# Altium schematic sheet Buzzer and Relay.SchDoc
size A; SheetNumber: 4; SheetTotal: 8; SPICEModelCacheVCIOZCSS: <root> / <DocumentId>VCIOZCSS</DocumentId> / </root>
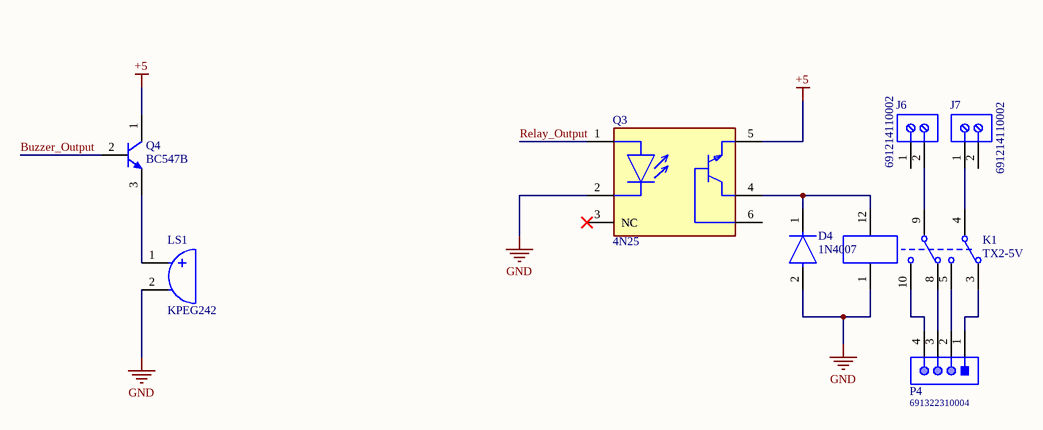
[diagram p0: Buzzer and Relay.SchDoc]

## Parts
D4  1N4007  [FP-1N4007-MFG]
J6  691214110002  [691214110002]
J7  691214110002  [691214110002]
K1  TX2-5V  [PNSC-TX2-5V_V]
LS1  KPEG242  [KINGS-KPEG242-2]
P4  691322310004  [691322310004]
Q3  4N25  [FP-4N25-MFG]
Q4  BC547B  [ONSC-TO-92-3-29-11]

## Nets
+5: Q3.5(C) Q4.1(C)
GND: D4.2(A) K1.1 LS1.2 Q3.2(C)
Buzzer_Output: Q4.2(B)
Relay_Output: Q3.1(A)
NetD4_1: D4.1(C) K1.12 Q3.4(E)
NetJ6_2: J6.2 K1.9
NetJ7_1: J7.1 K1.4
NetK1_3: K1.3 P4.1
NetK1_5: K1.5 P4.2
NetK1_8: K1.8 P4.3
NetK1_10: K1.10 P4.4
NetLS1_1: LS1.1 Q4.3(E)

Not connected (* = marked no-connect by the designer): J6 1; J7 2; Q3 3(NC)* 6(B)

## Library data of the parts
D4 = CMP-123542-000001-1: Rectifier diode 1000 V 1 A DO-41, ,; Manufacturer: Diotec; Max Surge Forward Current: 27A; Forward Current: 1A; Max Junction Temp: +175°C; Reverse Voltage: 1000V; Value: 15pF; Peak Reverse Current: 5uA; Category: Diode; Temperature Range Low: -50°C; Automotive: No; Temperature: -50°C to +175°C; Lead Free: Yes; ComponentLink2Description: Datasheet; Max Repetitive Reverse Voltage: 1000V; ComponentLink2URL: https://datasheet.octopart.com/1N4007-Diotec-datasheet-62346875.pdf; Manufacturer Part Number: 1N4007; Device Class L3: Rectifier Diodes; Height: 2.8mm; Octopart: https://octopart.com/1n4007-diotec-4040411; Package: 1N4007; Temperature Range High: +175°C; Device Class L1: Discrete Semiconductors; Device Class L2: Diodes; RoHS: TRUE; Capacitance: 15pF; Ipc Land Pattern Name: DIOAD888W100L520D280
J6 J7 = CMP-1502-02464-1: Serie 2141 - 3.50 mm Horizontal Entry Modular with Rising Cage Clamp WR-TBL, 2 pin; Manufacturer: Wurth Elektronik; Pin Number: 2; Pitch: 3.50mm; Datasheet URL: http://katalog.we-online.de/em/datasheet/6912141100xx.pdf; Packaging: Box; Mounting Technology: THT; Package Reference: 691214110002; Manufacturer URL: http://www.we-online.de; Part Number: 691214110002; Publisher: WurthElektronik; Operating Temperature: -40to105degC
K1 = CMP-2000-07334-1: 2000 V AC Breakdown Voltage, 2 Form C and 2 A Relay, Coil Votage 5 V, 28.1 mA, 178 Ohm, 140 mW, -40 to 85 degC, 8-Pin THD, RoHS, Tube; Manufacturer: Panasonic; Coil Resistance: 178ohm; Contact Current Min: 10µA; Coil Operating Upper Percent Limit: 150%; Approval Category: EN41003; Coil Voltage VDC Nom: 5V; External Width: 7.4mm; Nom Operating Power: 140mW; Approval Bodies: CSA/UL; Contact Current DC Max: 2A; Contact Voltage DC Nom: 30V; Coil Current: 28.1mA; Contact Voltage AC Max: 125V; Operating Time: 4ms; Contact Configuration: DPCO; Contact Current AC Max: 500mA; Relay Type: GeneralPurpose; External Height: 15mm; Contact Voltage AC Nom: 250V; External Depth: 8.2mm; PCB Hole Diameter: 1mm; No. of Poles: 2; Relay Mounting: ThroughHole; SVHC: NoSVHC(19-Dec-2012); Coil Type: DC; Coil Operating Lower Percent Limit: 75%; Manufacturer URL: http://www.panasonic.com/; Contact Material: SilverAlloy,GoldClad; Mounting Type: PCB; Package Reference: TX2-5V; Operating Temperature Min: -40°C; Datasheet URL: http://www3.panasonic.biz/ac/e_download/control/relay/signal/catalog/mech_eng_tx.pdf?f_cd=302302; Contact Voltage DC Max: 30V; Contact Current Max: 2A; Operating Temperature Max: 85°C; Coil Power Cont: 140mW; Contact Plating: Gold; DC Coil Power: 140mW; Datasheet Version: 07/2014; Package Description: 8-Pin Through Hole Relay, Body 15 x 7.4 mm; External Length / Height: 15mm; Mounting Technology: ThroughHole; Lead Spacing: 2.54mm
LS1 = CMP-2000-06518-1: Piezo Indicator, 4100 Hz, 3 to 16 V, -20 to 70 degC, 2-Pin THD, RoHS; PartNumber: KPE-242; Manufacturer: KingstateElectronicsCorp.; Frequency Range: 3600to4600Hz; Maximum Supply Current: 7mA; Typical Operating Supply Voltage: 12Vdc; Product Height: 7.6mm; Current - Max: 7A; Tone Mode: Continuous; Product Diameter: 13.7mm; Minimum Sound Pressure: 70dBA; Maximum Resonant Frequency: 4600Hz; Type: Indicator; Datasheet URL: https://datasheet.ciiva.com/11776/0900766b8068f3a2-11776713.pdf; Mounting: ThroughHole; Technology: Piezo; Operating Temperature: -20to70°C; Category: AudioIndicatorsandAlerts; Termination Method: Pin; Manufacturer URL: http://www.kingstate.com.tw/index.php/en/; Package Description: 2-Pin Through Hole Device, Body Dia 13.7 mm, Pitch 7.62 mm; Datasheet Version: 01/2006; Package Reference: KPEG242; Mounting Technology: ThroughHole
P4 = CMP-1502-01888-1: Serie 322 - 3.81mm Horizontal PCB Header WR-TBL, 4 pin; Manufacturer: Wurth Elektronik; Gender: Male; Pin Number: 4; Package Reference: 691322310004; Part Number: 691322310004; Publisher: WurthElektronik; Packaging: Box; Mounting Technology: THT; Manufacturer URL: http://www.we-online.de; Operating Temperature: -40to105degC; Pitch: 3.81mm; Datasheet URL: http://katalog.we-online.de/em/datasheet/6913223100xx.pdf
Q3 = CMP-22018-000009-1: OPTOISO 2.5KV TRANS W/BASE 6DIP; Isolation Voltage: 5kV; Reverse Breakdown Voltage: 5V; Forward Voltage: 1.5V; Rise Time: 2us; Max Power Dissipation: 250mW; Collector Emitter Breakdown Voltage: 30V; Max Collector Current: 100mA; Collector Emitter Saturation Voltage: 500mV; Power Dissipation: 150mW; Number of Elements: 1; Forward Current: 60mA; Output Voltage: 70V; Input Type: DC; Max Input Current: 80mA; Input Current: 50mA; Current Transfer Ratio: 50%; Number of Pins: 6; Min Operating Temperature: -55°C; Radiation Hardening: No; Case/Package: PDIP; Fall Time: 2us; Lead Free: Lead Free; Series: -; Max Operating Temperature: 100°C; Output Current per Channel: 100mA; Number of Circuits: 1; Collector Emitter Voltage (VCEO): 30V; Isolation Voltage-Max: 5kV; Collector-emitter Voltage-Max: 500mV; Packaging: Rail/Tube; Mount: Through Hole; Package Quantity: 2000; Max Output Voltage: 30V; Number of Channels: 1
Q4 = CMP-1048-01467-1: Amplifier Transistor, NPN Silicon, 3-Pin TO-92, Bulk Box; Manufacturer: On Semiconductor; IC Continuous (A): 0.1; fT Min (MHz): 150; DatasheetVersion: Rev. 7; ComponentLink1URL: http://www.onsemi.com/; Polarity: NPN; RoHS: FALSE; ComponentLink1Description: Manufacturer URL; Packing: Bulk Box; PackageDescription: 3-Pin Transistor Outline, Body 4.825 x 3.685 mm, Pitch 1.27 mm; ComponentLink3URL: http://www.onsemi.cn/pub_link/Collateral/2N6426-D.PDF; ComponentLink2Description: Datasheet; PackageVersion: Rev. AM; PackageReference: TO-92-3-29-11_AM_SL; ComponentLink3Description: Package Specification; Mounting Technology: Through Hole; PartNumber: BC547B; ComponentLink2URL: http://www.onsemi.com/pub_link/Collateral/BC546-D.PDF